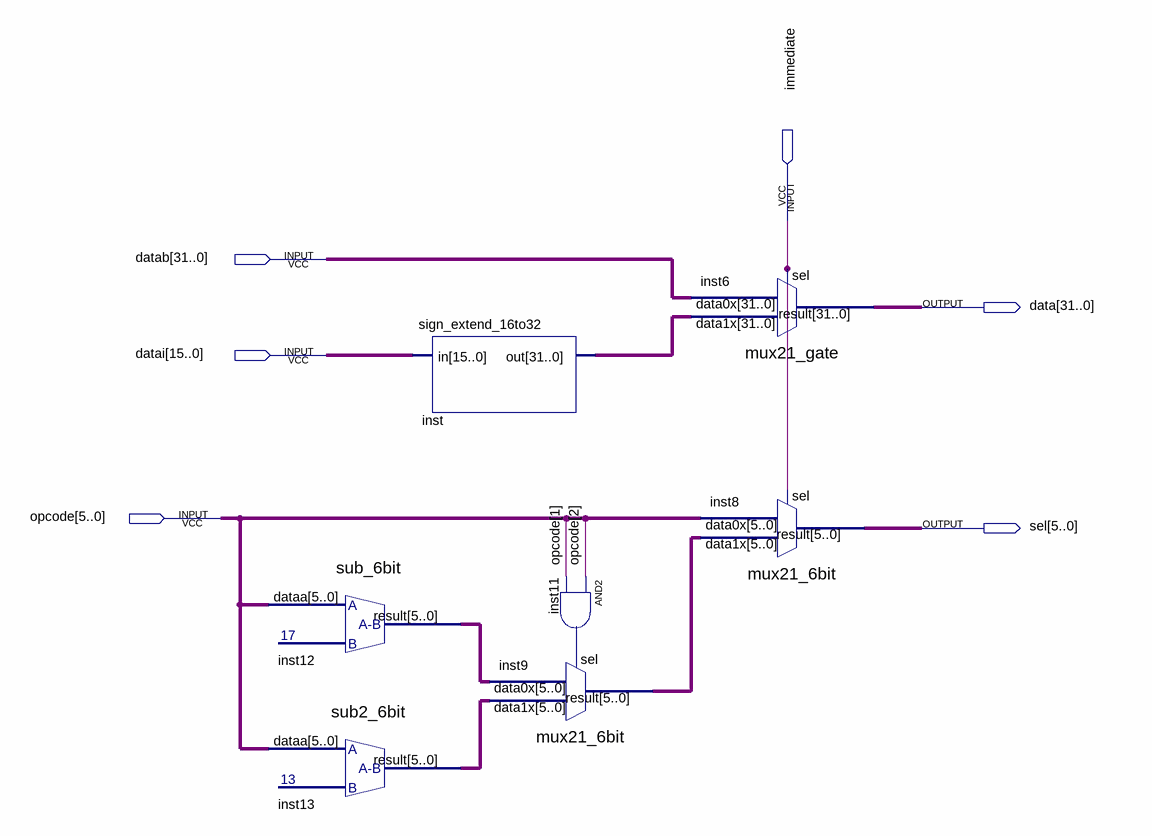
[diagram p0: schematic sheet]
// Quartus schematic immediate_sel.bdf as structural Verilog: 7 symbols, 6 pins
module immediate_sel (
  input  immediate,
  input  [31:0] datab,
  input  [15:0] datai,
  input  [5:0] opcode,
  output [31:0] data,
  output [5:0] sel
);

  wire inst11_out;
  wire [5:0] inst9_result, inst12_result, inst13_result;
  wire [31:0] inst_out;

  sub_6bit inst12 (.dataa(opcode), .result(inst12_result));
  sub2_6bit inst13 (.dataa(opcode), .result(inst13_result));
  sign_extend_16to32 inst (.in(datai), .out(inst_out));
  mux21_6bit inst9 (.data1x(inst13_result), .data0x(inst12_result), .sel(inst11_out), .result(inst9_result));
  and inst11 (inst11_out, opcode[2], opcode[1]);
  mux21_gate inst6 (.data1x(inst_out), .data0x(datab), .sel(immediate), .result(data));
  mux21_6bit inst8 (.data1x(inst9_result), .data0x(opcode), .sel(immediate), .result(sel));
endmodule
